# Altium schematic sheet DIV2_8B.SCHDOC: LiveDesign Evaluation - Video Windows
size A4; Organization: Altium Limited; Address1: L3, 12a Rodborough Rd; Address2: Frenchs Forest; Address3: NSW; Address4: Australia 2086; DocumentNumber: 18; SheetNumber: 18; SheetTotal: 20
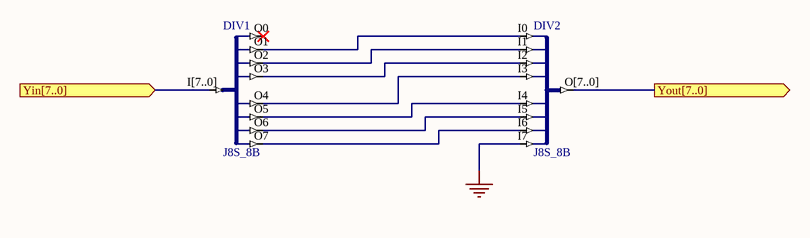
[diagram p0: DIV2_8B.SCHDOC]

## Parts
DIV1  J8S_8B
DIV2  J8S_8B

## Ports
Yin[7..0] (in), Yout[7..0] (out)

## Nets
GND: DIV2.I7
Yin[7..0]: DIV1.I[7..0] ; port Yin[7..0]
Yout[7..0]: DIV2.O[7..0] ; port Yout[7..0]
NetDIV1_O1: DIV1.O1 DIV2.I0
NetDIV1_O2: DIV1.O2 DIV2.I1
NetDIV1_O3: DIV1.O3 DIV2.I2
NetDIV1_O4: DIV1.O4 DIV2.I3
NetDIV1_O5: DIV1.O5 DIV2.I4
NetDIV1_O6: DIV1.O6 DIV2.I5
NetDIV1_O7: DIV1.O7 DIV2.I6

Not connected (* = marked no-connect by the designer): DIV1 O0*

## Notes on the sheet
- Title
- Size:
- Date:
- A4
- Number:
- Time:
- Revision:
- Sheet
- of
- File:

## Library data of the parts
DIV1 = J8B_8S: 8-Bit input bus to 8 single pin outputs; ArchiveName: GENERIC; Published: 9-30-2003; Publisher: Altium Limited; Core Revision: 1.00.00
DIV2 = J8S_8B: 8 Single pin inputs to single 8-Bit output bus; ArchiveName: GENERIC; Published: 9-30-2003; Publisher: Altium Limited; Core Revision: 1.00.00